# Altium project RobotCtrl_Func.PrjPcb
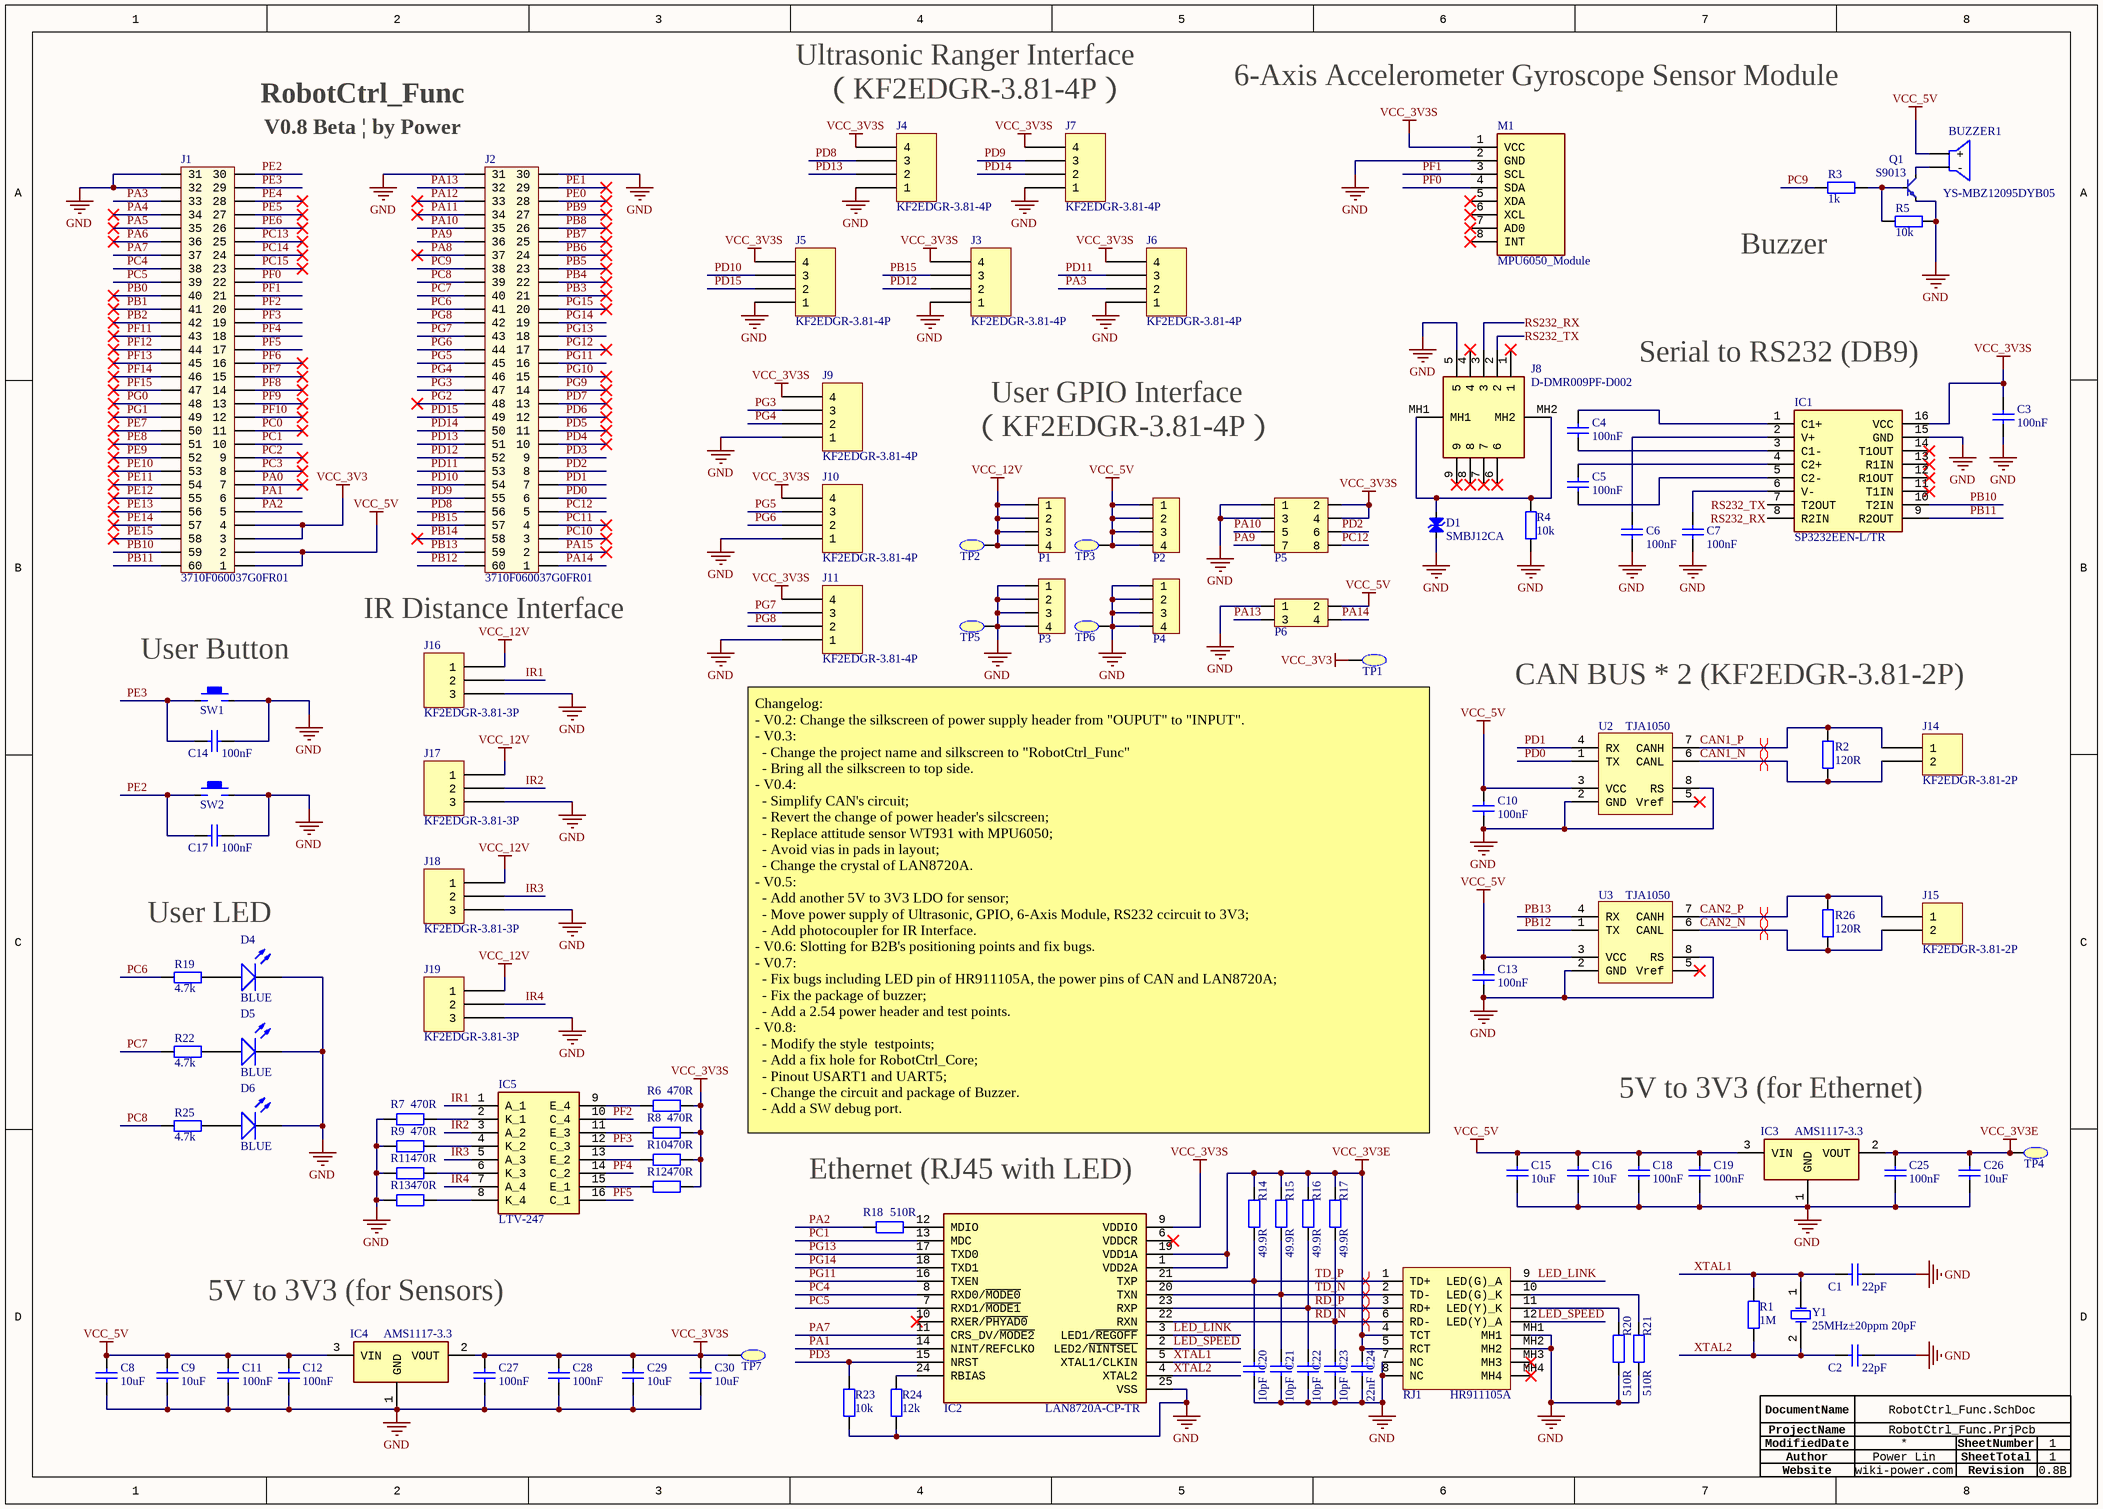
[diagram p0: RobotCtrl_Func.SchDoc]
1 sheet, 104 parts. Net scope: global (net labels, ports and power ports of the same name join across sheets).
Board file: RobotCtrl_Func.PcbDoc

## Sheet RobotCtrl_Func.SchDoc
size A3; Author: Power Lin; DocumentNumber: 1; Revision: 0.8B; SheetNumber: 1; SheetTotal: 1; Website: wiki-power.com

### Parts
BUZZER1  YS-MBZ12095DYB05  [DIP,P=7.6mm]
C1  22pF  [CAP-0603]
C2  22pF  [CAP-0603]
C3  100nF  [CAP-0603]
C4  100nF  [CAP-0603]
C5  100nF  [CAP-0603]
C6  100nF  [CAP-0603]
C7  100nF  [CAP-0603]
C8  10uF  [CAP-0603]
C9  10uF  [CAP-0603]
C10  100nF  [CAP-0603]
C11  100nF  [CAP-0603]
C12  100nF  [CAP-0603]
C13  100nF  [CAP-0603]
C14  100nF  [CAP-0603]
C15  10uF  [CAP-0603]
C16  10uF  [CAP-0603]
C17  100nF  [CAP-0603]
C18  100nF  [CAP-0603]
C19  100nF  [CAP-0603]
C20  10pF  [CAP-0603]
C21  10pF  [CAP-0603]
C22  10pF  [CAP-0603]
C23  10pF  [CAP-0603]
C24  22nF  [CAP-0603]
C25  100nF  [CAP-0603]
C26  10uF  [CAP-0603]
C27  100nF  [CAP-0603]
C28  100nF  [CAP-0603]
C29  10uF  [CAP-0603]
C30  10uF  [CAP-0603]
D1  SMBJ12CA  [DO-214AA/SMB]
D4  BLUE  [LED-0603]
D5  BLUE  [LED-0603]
D6  BLUE  [LED-0603]
IC1  SP3232EEN-L/TR  [SOIC-16_150mil]
IC2  LAN8720A-CP-TR  [QFN-24-4x4]
IC3  AMS1117-3.3  [SOT-223]
IC4  AMS1117-3.3  [SOT-223]
IC5  LTV-247  [LTV247]
J1  3710F060037G0FR01  [3710M060037G3FT01]
J2  3710F060037G0FR01  [3710M060037G3FT01]
J3  KF2EDGR-3.81-4P  [FCI 06-381-4PIN]
J4  KF2EDGR-3.81-4P  [FCI 06-381-4PIN]
J5  KF2EDGR-3.81-4P  [FCI 06-381-4PIN]
J6  KF2EDGR-3.81-4P  [FCI 06-381-4PIN]
J7  KF2EDGR-3.81-4P  [FCI 06-381-4PIN]
J8  D-DMR009PF-D002  [Through Hole,P=2.77mm]
J9  KF2EDGR-3.81-4P  [FCI 06-381-4PIN]
J10  KF2EDGR-3.81-4P  [FCI 06-381-4PIN]
J11  KF2EDGR-3.81-4P  [FCI 06-381-4PIN]
J14  KF2EDGR-3.81-2P  [FCI 06-381-2PIN]
J15  KF2EDGR-3.81-2P  [FCI 06-381-2PIN]
J16  KF2EDGR-3.81-3P  [FCI 06-381-3PIN]
J17  KF2EDGR-3.81-3P  [FCI 06-381-3PIN]
J18  KF2EDGR-3.81-3P  [FCI 06-381-3PIN]
J19  KF2EDGR-3.81-3P  [FCI 06-381-3PIN]
M1  MPU6050_Module  [MPU6050_Module_SMD]
P1  HDR1x4_2.54  [HDR1X4_2.54]  (value not drawn)
P2  HDR1x4_2.54  [HDR1X4_2.54]  (value not drawn)
P3  HDR1x4_2.54  [HDR1X4_2.54]  (value not drawn)
P4  HDR1x4_2.54  [HDR1X4_2.54]  (value not drawn)
P5  HDR2x4_2.54  [HDR2X4_2.54_180]  (value not drawn)
P6  HDR2x2_2.54  [HDR2X2_2.54_180]  (value not drawn)
Q1  S9013  [SOT-23-3]
R1  1M  [R-0603]
R2  120R  [R-0603]
R3  1k  [R-0603]
R4  10k  [R-0603]
R5  10k  [R-0603]
R6  470R  [R-0603]
R7  470R  [R-0603]
R8  470R  [R-0603]
R9  470R  [R-0603]
R10  470R  [R-0603]
R11  470R  [R-0603]
R12  470R  [R-0603]
R13  470R  [R-0603]
R14  49.9R  [R-0603]
R15  49.9R  [R-0603]
R16  49.9R  [R-0603]
R17  49.9R  [R-0603]
R18  510R  [R-0603]
R19  4.7k  [R-0603]
R20  510R  [R-0603]
R21  510R  [R-0603]
R22  4.7k  [R-0603]
R23  10k  [R-0603]
R24  12k  [R-0603]
R25  4.7k  [R-0603]
R26  120R  [R-0603]
RJ1  HR911105A  [HR911105A]
SW1  KEY  [KEY-4P-4.2*3.4*2.5]  (value not drawn)
SW2  KEY  [KEY-4P-4.2*3.4*2.5]  (value not drawn)
TP1  TestPoint  [TestPoint]  (value not drawn)
TP2  TestPoint  [TestPoint]  (value not drawn)
TP3  TestPoint  [TestPoint]  (value not drawn)
TP4  TestPoint  [TestPoint]  (value not drawn)
TP5  TestPoint  [TestPoint]  (value not drawn)
TP6  TestPoint  [TestPoint]  (value not drawn)
TP7  TestPoint  [TestPoint]  (value not drawn)
U2  TJA1050  [SOIC_8]
U3  TJA1050  [SOIC_8]
Y1  25MHz±20ppm 20pF  [SMD5032-2P]

### Nets
GND: C1.1 C2.1 C3.1 C6.1 C7.1 C8.1 C9.1 C10.1 C11.1 C12.1 C13.1 C14.1 C15.1 C16.1 C17.1 C18.1 C19.1 C20.1 C21.1 C22.1 C23.1 C24.1 C25.1 C26.1 C27.1 C28.1 C29.1 C30.1 D1.1 D4.K D5.K D6.K IC1.15(GND) IC2.25(VSS) IC3.1(GND) IC4.1(GND) J1.31 J1.32 J2.30 J2.31 J3.1 J4.1 J5.1 J6.1 J7.1 J8.5 J9.1 J10.1 J11.1 J16.3 J17.3 J18.3 J19.3 M1.2(GND) P3.1 P3.2 P3.3 P3.4 P4.1 P4.2 P4.3 P4.4 P5.1 P5.3 P6.1 Q1.2(E) R4.1 R5.1 R7.2 R9.2 R11.2 R13.2 R20.1 R21.1 R23.2 R24.2 RJ1.7(NC) RJ1.8(NC) RJ1.MH1 RJ1.MH2 SW1.2 SW2.2 TP5.1 TP6.1 U2.2(GND) U2.8(RS) U3.2(GND) U3.8(RS)
VCC_3V3: J1.3 J1.4 TP1.1
VCC_3V3E: C24.2 C25.2 C26.2 IC2.1(VDD2A) IC2.19(VDD1A) IC3.2(VOUT) R14.2 R15.2 R16.2 R17.2 RJ1.4(TCT) RJ1.5(RCT) TP4.1
VCC_3V3S: C3.2 C27.2 C28.2 C29.2 C30.2 IC1.16(VCC) IC2.9(VDDIO) IC4.2(VOUT) J3.4 J4.4 J5.4 J6.4 J7.4 J9.4 J10.4 J11.4 M1.1(VCC) P5.2 P5.4 R6.1 R8.1 R10.1 R12.1 TP7.1
VCC_5V: BUZZER1.1(+) C8.2 C9.2 C10.2 C11.2 C12.2 C13.2 C15.2 C16.2 C18.2 C19.2 IC3.3(VIN) IC4.3(VIN) J1.1 J1.2 P2.1 P2.2 P2.3 P2.4 P6.2 TP3.1 U2.3(VCC) U3.3(VCC)
VCC_12V: J16.1 J17.1 J18.1 J19.1 P1.1 P1.2 P1.3 P1.4 TP2.1
CAN1_N: J14.2 R2.2 U2.6(CANL)
CAN1_P: J14.1 R2.1 U2.7(CANH)
CAN2_N: J15.2 R26.2 U3.6(CANL)
CAN2_P: J15.1 R26.1 U3.7(CANH)
IR1: IC5.1(A_1) J16.2
IR2: IC5.3(A_2) J17.2
IR3: IC5.5(A_3) J18.2
IR4: IC5.7(A_4) J19.2
LED_LINK: IC2.3(LED1/~{REGOFF}) RJ1.9(LED(G)_A)
LED_SPEED: IC2.2(LED2/~{NINTSEL}) RJ1.12(LED(Y)_A)
PA0: J1.7
PA1: IC2.14(NINT/REFCLKO) J1.6
PA2: J1.5 R18.2
PA3: J1.33 J6.2
PA4: J1.34
PA5: J1.35
PA6: J1.36
PA7: IC2.11(CRS_DV/~{MODE2}) J1.37
PA8: J2.37
PA9: J2.36 P5.7
PA10: J2.35 P5.5
PA11: J2.34
PA12: J2.33
PA13: J2.32 P6.3
PA14: J2.1 P6.4
PA15: J2.2
PB0: J1.40
PB1: J1.41
PB2: J1.42
PB3: J2.21
PB4: J2.22
PB5: J2.23
PB6: J2.24
PB7: J2.25
PB8: J2.26
PB9: J2.27
PB10: IC1.10(T2IN) J1.59
PB11: IC1.9(R2OUT) J1.60
PB12: J2.60 U3.1(TX)
PB13: J2.59 U3.4(RX)
PB14: J2.58
PB15: J2.57 J3.3
PC0: J1.11
PC1: IC2.13(MDC) J1.10
PC2: J1.9
PC3: J1.8
PC4: IC2.8(RXD0/~{MODE0}) J1.38
PC5: IC2.7(RXD1/~{MODE1}) J1.39
PC6: J2.41 R19.2
PC7: J2.40 R22.2
PC8: J2.39 R25.2
PC9: J2.38 R3.1
PC10: J2.3
PC11: J2.4
PC12: J2.5 P5.8
PC13: J1.25
PC14: J1.24
PC15: J1.23
PD0: J2.6 U2.1(TX)
PD1: J2.7 U2.4(RX)
PD2: J2.8 P5.6
PD3: IC2.15(NRST) J2.9 R23.1
PD4: J2.10
PD5: J2.11
PD6: J2.12
PD7: J2.13
PD8: J2.56 J4.3
PD9: J2.55 J7.3
PD10: J2.54 J5.3
PD11: J2.53 J6.3
PD12: J2.52 J3.2
PD13: J2.51 J4.2
PD14: J2.50 J7.2
PD15: J2.49 J5.2
PE0: J2.28
PE1: J2.29
PE2: C17.2 J1.30 SW2.1
PE3: C14.2 J1.29 SW1.1
PE4: J1.28
PE5: J1.27
PE6: J1.26
PE7: J1.50
PE8: J1.51
PE9: J1.52
PE10: J1.53
PE11: J1.54
PE12: J1.55
PE13: J1.56
PE14: J1.57
PE15: J1.58
PF0: J1.22 M1.4(SDA)
PF1: J1.21 M1.3(SCL)
PF2: IC5.10(C_4) J1.20
PF3: IC5.12(C_3) J1.19
PF4: IC5.14(C_2) J1.18
PF5: IC5.16(C_1) J1.17
PF6: J1.16
PF7: J1.15
PF8: J1.14
PF9: J1.13
PF10: J1.12
PF11: J1.43
PF12: J1.44
PF13: J1.45
PF14: J1.46
PF15: J1.47
PG0: J1.48
PG1: J1.49
PG2: J2.48
PG3: J2.47 J9.3
PG4: J2.46 J9.2
PG5: J2.45 J10.3
PG6: J2.44 J10.2
PG7: J2.43 J11.3
PG8: J2.42 J11.2
PG9: J2.14
PG10: J2.15
PG11: IC2.16(TXEN) J2.16
PG12: J2.17
PG13: IC2.17(TXD0) J2.18
PG14: IC2.18(TXD1) J2.19
PG15: J2.20
RD_N: C23.2 IC2.22(RXN) R17.1 RJ1.6(RD-)
RD_P: C22.2 IC2.23(RXP) R16.1 RJ1.3(RD+)
RS232_RX: IC1.8(R2IN) J8.3
RS232_TX: IC1.7(T2OUT) J8.2
TD_N: C21.2 IC2.20(TXN) R15.1 RJ1.2(TD-)
TD_P: C20.2 IC2.21(TXP) R14.1 RJ1.1(TD+)
XTAL1: C1.2 IC2.5(XTAL1/CLKIN) R1.2 Y1.1(OSC1)
XTAL2: C2.2 IC2.4(XTAL2) R1.1 Y1.2(OSC2)
NetBUZZER1_2: BUZZER1.2(-) Q1.3(C)
NetC4_1: C4.1 IC1.3(C1-)
NetC4_2: C4.2 IC1.1(C1+)
NetC5_1: C5.1 IC1.5(C2-)
NetC5_2: C5.2 IC1.4(C2+)
NetC6_2: C6.2 IC1.2(V+)
NetC7_2: C7.2 IC1.6(V-)
NetD1_2: D1.2 J8.MH1 J8.MH2 R4.2
NetD4_A: D4.A R19.1
NetD5_A: D5.A R22.1
NetD6_A: D6.A R25.1
NetIC2_12: IC2.12(MDIO) R18.1
NetIC2_24: IC2.24(RBIAS) R24.1
NetIC5_2: IC5.2(K_1) R7.1
NetIC5_4: IC5.4(K_2) R9.1
NetIC5_6: IC5.6(K_3) R11.1
NetIC5_8: IC5.8(K_4) R13.1
NetIC5_9: IC5.9(E_4) R6.2
NetIC5_11: IC5.11(E_3) R8.2
NetIC5_13: IC5.13(E_2) R10.2
NetIC5_15: IC5.15(E_1) R12.2
NetQ1_1: Q1.1(B) R3.2 R5.2
NetR20_2: R20.2 RJ1.11(LED(Y)_K)
NetR21_2: R21.2 RJ1.10(LED(G)_K)

Not connected (* = marked no-connect by the designer): IC1 11(T1IN)* 12(R1OUT)* 13(R1IN)* 14(T1OUT)*; IC2 6(VDDCR)* 10(RXER/~{PHYAD0})*; J8 1* 4* 6* 7* 8* 9*; M1 5(XDA)* 6(XCL)* 7(AD0)* 8(INT)*; RJ1 MH3* MH4*; U2 5(Vref)*; U3 5(Vref)*

### Layout directives
differential pair: CAN1_N, CAN1_P, CAN2_N, CAN2_P, RD_N, RD_P, TD_N, TD_P

### Notes on the sheet
- RobotCtrl_Func
- Ultrasonic Ranger Interface
- （KF2EDGR-3.81-4P）
- 6-Axis Accelerometer Gyroscope Sensor Module
- V0.8 Beta | by Power
- Buzzer
- Serial to RS232 (DB9)
- User GPIO Interface
- IR Distance Interface
- (near SW1) User Button
- CAN BUS * 2 (KF2EDGR-3.81-2P)
- User LED
- (near TP1) Changelog:
  - V0.2: Change the silkscreen of power supply header from "OUPUT" to "INPUT".
  - V0.3:
  - Change the project name and silkscreen to "RobotCtrl_Func"
  - Bring all the silkscreen to top side.
  - V0.4:
  - Simplify CAN's circuit;
  - Revert the change of power header's silcscreen;
  - Replace attitude sensor WT931 with MPU6050;
  - Avoid vias in pads in layout;
  - Change the crystal of LAN8720A.
  - V0.5:
  - Add another 5V to 3V3 LDO for sensor;
  - Move power supply of Ultrasonic, GPIO, 6-Axis Module, RS232 ccircuit to 3V3;
  - Add photocoupler for IR Interface.
  - V0.6: Slotting for B2B's positioning points and fix bugs.
  - V0.7:
  - Fix bugs including LED pin of HR911105A, the power pins of CAN and LAN8720A;
  - Fix the package of buzzer;
  - Add a 2.54 power header and test points.
  - V0.8:
  - Modify the style  testpoints;
  - Add a fix hole for RobotCtrl_Core;
  - Pinout USART1 and UART5;
  - Change the circuit and package of Buzzer.
  - Add a SW debug port.
- 5V to 3V3 (for Ethernet)
- Ethernet (RJ45 with LED)
- 5V to 3V3 (for Sensors)
- Author
- (near C2) DocumentName
- ModifiedDate
- ProjectName
- SheetNumber
- SheetTotal
- Website
- Revision

### Library data of the parts
BUZZER1 = BUZZER: YS-MBZ12095DYB05 有源蜂鸣器
C1-C30 = CAP: 贴片电容; ComponentLink1Description: 供应商链接; ComponentLink1URL: http://www.szlcsc.com/product/details_53938.html; Package: 0402; Supplier: LC; SuppliersPartNumber: C52923
D1 = TVS_C
D4-D6 = LED: 发光二极管; pin to pad: A>1 K>2; ComponentLink1Description: 供应商链接; ComponentLink1URL: http://www.szlcsc.com/product/details_2663.html; Package: 0603; Supplier: LC; SuppliersPartNumber: C2290
IC1 = SP3232EEN: RS232 芯片; Manufacturer_Name: MaxLinear; Datasheet Link: https://www.maxlinear.com/ds/sp3222e_sp3232e.pdf; Height: 1.75mm; Manufacturer_Part_Number: SP3232EEN-L/TR; Mouser Part Number: 701-SP3232EEN-L/TR; Mouser Price/Stock: https://www.mouser.co.uk/ProductDetail/MaxLinear/SP3232EEN-L-TR?qs=Hy8V1%2FADhVKNh9v9NvoeCw%3D%3D; Arrow Part Number: SP3232EEN-L/TR; Arrow Price/Stock: https://www.arrow.com/en/products/sp3232een-ltr/maxlinear-inc
IC2 = LAN8720A-CP-TR: Integrated Circuit; Manufacturer_Name: Microchip; Datasheet Link: https://componentsearchengine.com/Datasheets/1/LAN8720A-CP-TR.pdf; Height: 1mm; Manufacturer_Part_Number: LAN8720A-CP-TR; Mouser Part Number: 886-LAN8720A-CP-TR; Mouser Price/Stock: https://www.mouser.co.uk/ProductDetail/Microchip-Technology/LAN8720A-CP-TR?qs=pA5MXup5wxG3QiSvrqf%2FHQ%3D%3D; Arrow Part Number: LAN8720A-CP-TR; Arrow Price/Stock: https://www.arrow.com/en/products/lan8720a-cp-tr/microchip-technology?region=nac
IC3 IC4 = AMS1117: AMS1117-3.3 1.0A; Manufacturer_Name: Nexperia; Manufacturer_Part_Number: SI2302DS; Datasheet Link: https://assets.nexperia.com/documents/data-sheet/SI2302DS.pdf; Height: 1.1mm; Mouser Part Number: N/A; Mouser Price/Stock: https://www.mouser.com/Search/Refine.aspx?Keyword=N%2FA; RS Part Number: 7983053P; RS Price/Stock: http://uk.rs-online.com/web/p/products/7983053P
IC5 = LTV-247: Integrated Circuit; Manufacturer_Name: Lite-On; Datasheet Link: http://optoelectronics.liteon.com/upload/download/DS70-2009-0014/LTV-2X7%20sereis%20Mar17.PDF; Height: 2.42mm; Manufacturer_Part_Number: LTV-247; Mouser Part Number: 859-LTV-247; Mouser Price/Stock: https://www.mouser.co.uk/ProductDetail/Lite-On/LTV-247?qs=9ayhpukWNmvWpoxQBzWkFA%3D%3D; Arrow Part Number: LTV-247; Arrow Price/Stock: https://www.arrow.com/en/products/ltv-247/lite-on-technology?region=nac
J1 J2 = 3710M/F: B2B Connector; System: Connector
J3-J7 J9-J11 = KF2EDGR-3.81-4P: TERM BLOCK HDR 4POS 90DEG 3.81MM; Part Number: OQ0432510000G; Manufacturer: Amphenol Anytek; Voltage - UL: 300V; Header Orientation: 90°, Right Angle; Current - UL: 10A; Positions Per Level: 4; Pitch: 0.150" (3.81mm); Number of Levels: 1; Operating Temperature: -40°C ~ 115°C; Type: Header, Male Pins, Shrouded (4 Side); Contact Mating Finish: Tin; Minimum Order: 1; ComponentLink1Description: Datasheet; Color: Green; Series: 06-381; Lifecycle Status: 0; Mounting Type: Through Hole; Number of Positions: 4; Part Status: Active; Packaging: Bulk; Termination Style: Solder; LastUpdated: 2019-12-16 19:15:03.463; ComponentLink1URL: http://portal.fciconnect.com/Comergent//fci/drawing/oqxx32x100j0g.pdf; Price: 0.71; Manufacturer Part Number: OQ0432510000G; Component Type: 接线端子
J8 = DB9: D-Sub 连接器; Manufacturer_Name: TE Connectivity; Manufacturer_Part_Number: 5747844-5; Datasheet Link: http://www.te.com/commerce/DocumentDelivery/DDEController?Action=srchrtrv&DocNm=82068_AMPLIMITE_Right-Angle_Posted_Conn&DocType=Catalog+Section&DocLang=English&PartCntxt=; Height: 12.9286mm; Mouser Part Number: 571-5747844-5; Mouser Price/Stock: https://www.mouser.co.uk/ProductDetail/TE-Connectivity/5747844-5?qs=x6EjVpvqMVPrkQsJHUlJGw%3D%3D; Arrow Part Number: 5747844-5; Arrow Price/Stock: https://www.arrow.com/en/products/5747844-5/te-connectivity
J14 J15 = KF2EDGR-3.81-2P: TERM BLOCK HDR 2POS 90DEG 3.81MM; Part Number: OQ0232510000G; Manufacturer: Amphenol Anytek; Manufacturer: Amphenol; Number of Levels: 1; Number of Positions: 2; Header Orientation: 90°, Right Angle; Current - UL: 10A; Pitch: 0.150" (3.81mm); Voltage - UL: 300V; Lifecycle Status: 0; ComponentLink1Description: Datasheet; Series: 06-381; Color: Green; Termination Style: Solder; Minimum Order: 1; Type: Header, Male Pins, Shrouded (4 Side); LastUpdated: 2019-12-16 19:14:30.110; Operating Temperature: -40°C ~ 115°C; Packaging: Bulk; ComponentLink1URL: http://portal.fciconnect.com/Comergent//fci/drawing/oqxx32x100j0g.pdf; Price: 0.49; Mounting Type: Through Hole; Positions Per Level: 2; Contact Mating Finish: Tin; Part Status: Active; Manufacturer Part Number: OQ0232510000G; Component Type: 接线端子
J16-J19 = KF2EDGR-3.81-3P: TERM BLOCK HDR 3POS 90DEG 3.81MM; Manufacturer: Amphenol Anytek; Part Number: OQ0332510000G; Current - UL: 10A; Positions Per Level: 3; Number of Levels: 1; Voltage - UL: 300V; Pitch: 0.150" (3.81mm); Header Orientation: 90°, Right Angle; ComponentLink1Description: Datasheet; Part Status: Active; Type: Header, Male Pins, Shrouded (4 Side); Contact Mating Finish: Tin; Termination Style: Solder; Minimum Order: 1; Series: 06-381; Lifecycle Status: 0; Operating Temperature: -40°C ~ 115°C; Color: Green; Packaging: Bulk; Number of Positions: 3; Price: 0.53; Mounting Type: Through Hole; LastUpdated: 2019-12-16 19:14:45.877; ComponentLink1URL: http://portal.fciconnect.com/Comergent//fci/drawing/oqxx32x100j0g.pdf; Manufacturer Part Number: OQ0332510000G; Component Type: 接线端子
M1 = MPU6050_Module: MPU6050 陀螺仪
P1-P4 = HDR1x4_2.54: Header; System: Connector
P5 = HDR2x4_2.54: Header
P6 = HDR2x2_2.54: Header
Q1 = BJT_NPN
R1-R5 R14-R26 = RES: 贴片电阻; Package: 0805; Supplier: LC; SuppliersPartNumber: C17798
R6-R13 = RES: 216R~540R, higer is better; Package: 0805; Supplier: LC; SuppliersPartNumber: C17798
RJ1 = RJ45_LED: 内置变压器的RJ45
SW1 SW2 = KEY: 按键开关
TP1-TP7 = TestPoint: 测试点
U2 U3 = TJA1050: CAN 控制器（5V）
Y1 = Crystal: TAXM25M2QLFCDT1T; ComponentLink1Description: 供应商链接; ComponentLink1URL: http://www.szlcsc.com/product/details_33310.html; Package: SMD-3215_2P; Supplier: LC; SuppliersPartNumber: C32346